# EAGLE design harp expander breakout v1.0 (EAGLE 9.5.1)
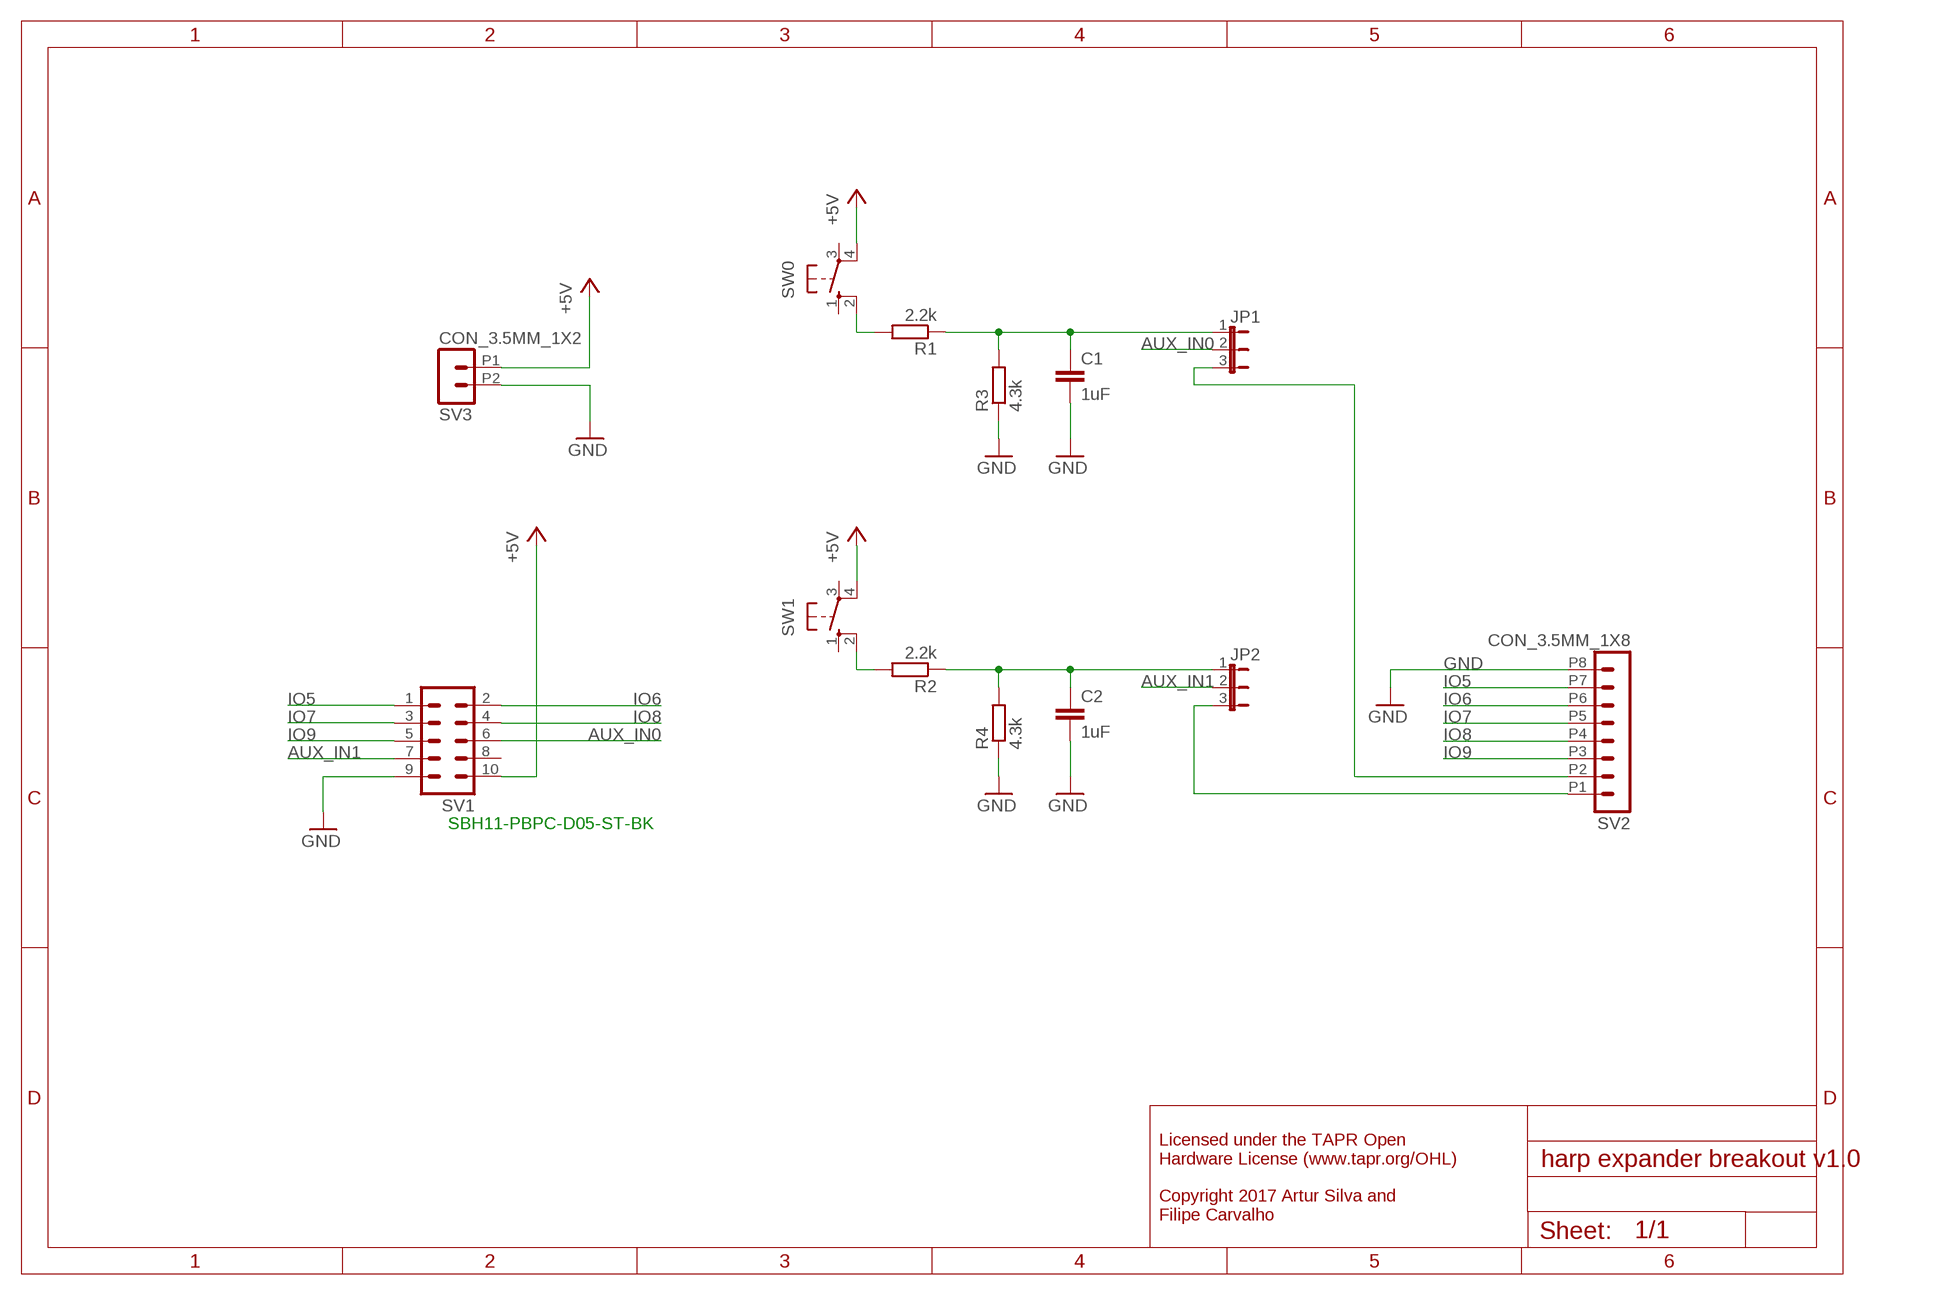
[diagram p0: schematic, sheet 1]

## Parts
C1  1uF  C-EUC0603  [C0603]
C2  1uF  C-EUC0603  [C0603]
JP1  JP2E  [JP2]
JP2  JP2E  [JP2]
R1  2.2k  R-EU_R0603  [R0603]
R2  2.2k  R-EU_R0603  [R0603]
R3  4.3k  R-EU_R0603  [R0603]
R4  4.3k  R-EU_R0603  [R0603]
SV1  ML10  [ML10]
SV2  CON_3.5MM_1X8  [CON_3.5MM_1X8]
SV3  CON_3.5MM_1X2  [CON_3.5MM_1X2]
SW0  40-XX  [B3F-40XX]
SW1  40-XX  [B3F-40XX]

## Nets
+5V: SV1.10 SV3.P1 SW0.4(P1) SW1.4(P1)
AUX_IN0: JP1.2 SV1.6
AUX_IN0_CONNECTOR: JP1.3 SV2.P2
AUX_IN1: JP2.2 SV1.7
AUX_IN1_CONNECTOR: JP2.3 SV2.P1
GND: C1.2 C2.2 R3.1 R4.1 SV1.9 SV2.P8 SV3.P2
IO5: SV1.1 SV2.P7
IO6: SV1.2 SV2.P6
IO7: SV1.3 SV2.P5
IO8: SV1.4 SV2.P4
IO9: SV1.5 SV2.P3
N$14: R2.2 SW1.2(S1)
N$16: C2.1 JP2.1 R2.1 R4.2
N$24: R1.2 SW0.2(S1)
N$25: C1.1 JP1.1 R1.1 R3.2
Unconnected: SV1.8 SW0.1(S) SW0.3(P) SW1.1(S) SW1.3(P)

## Notes on the sheet
- SBH11-PBPC-D05-ST-BK
- Licensed under the TAPR Open
  Hardware License (www.tapr.org/OHL)
  
  Copyright 2017 Artur Silva and 
  Filipe Carvalho

## Library data of the parts
C1 C2 = rcl:C-EU: CAPACITOR, European symbol
JP1 JP2 = jumper:JP2E: JUMPER
R1-R4 = rcl:R-EU_: RESISTOR, European symbol
SV1 = con-ml:ML10: HARTING; OC_FARNELL: unknown; OC_NEWARK: unknown
SV2 = CNP-connectors:CON_3.5MM_1X8
SV3 = CNP-connectors:CON_3.5MM_1X2
SW0 SW1 = switch-omron:40-XX: OMRON SWITCH; MF: OMRON COMPONENTS USA; MPN: B3F-4000; OC_FARNELL: 176434; OC_NEWARK: 36K3105

## Board
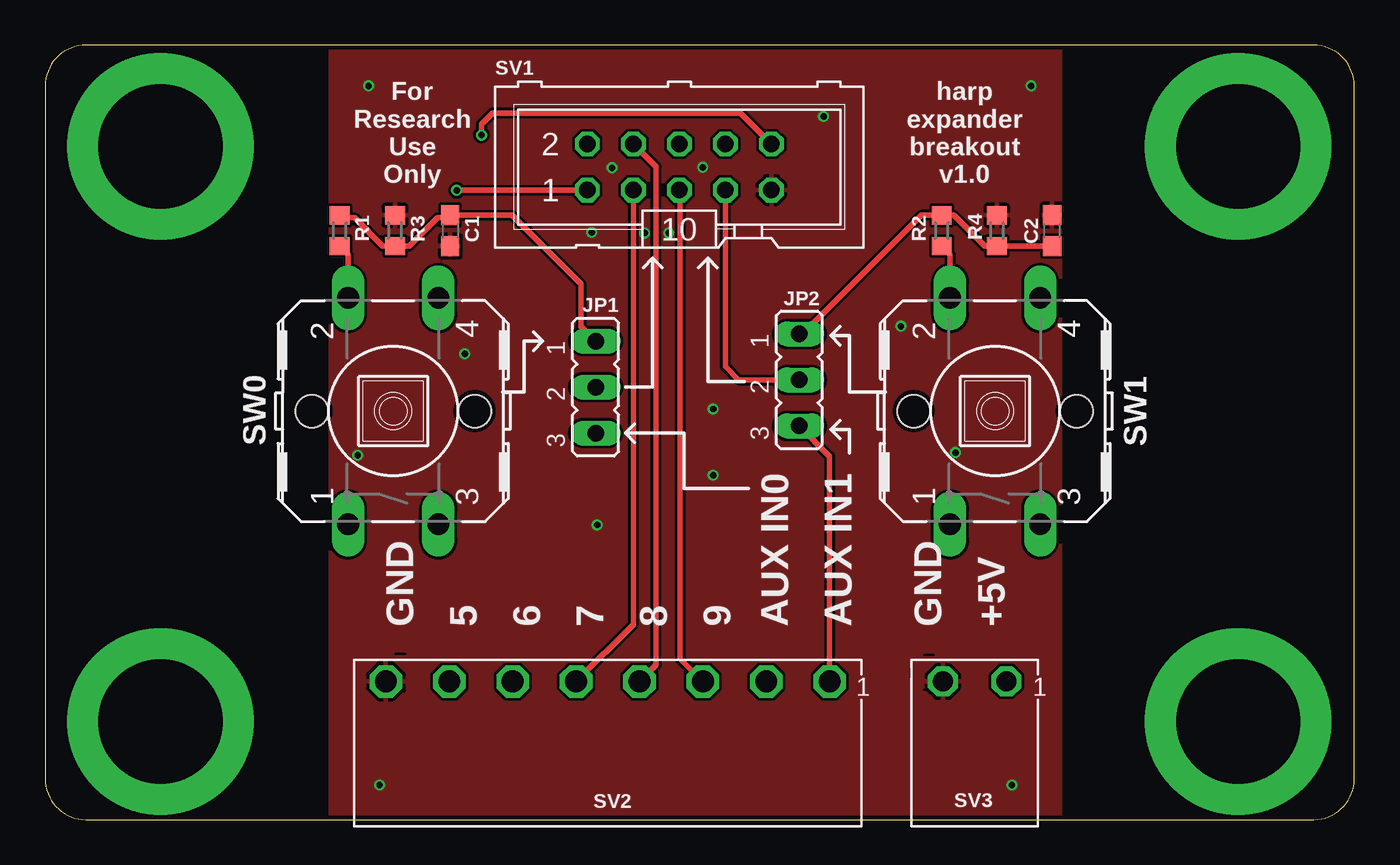
[diagram p1: board, top side]
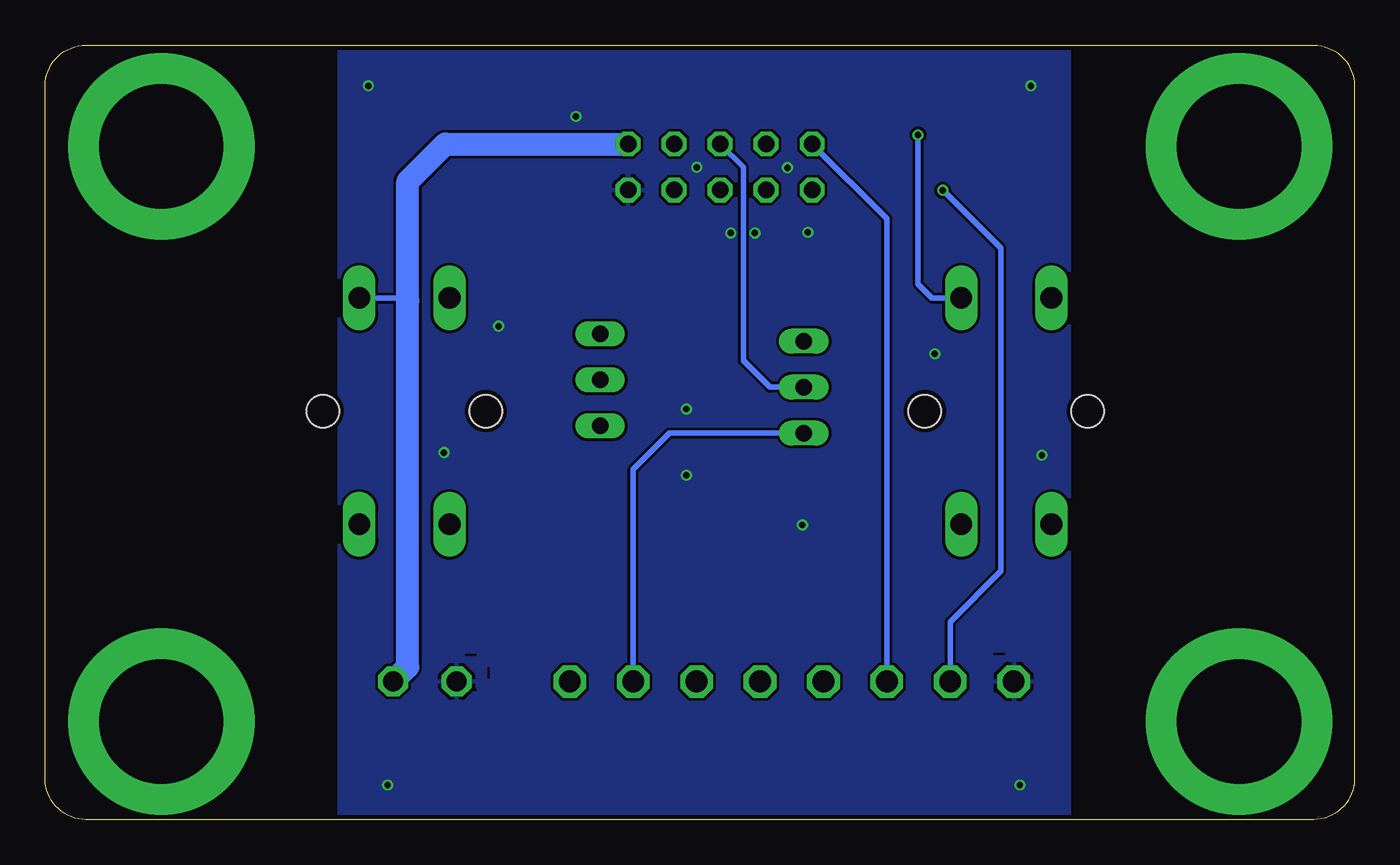
[diagram p2: board, bottom side, seen from below]

Size 72.25 x 42.75 mm. Coordinates in mm from the lower left corner, seen from the top.
Outline: 70.01,42.75 2.24,42.75 arc90 0,40.51 0,2.24 arc90 2.24,0 70.01,0 arc90 72.25,2.24 72.25,40.51 arc90 70.01,42.75
Copper layers (1*16): Top 0.018mm / dielectric 1.55mm / Bottom 0.018mm
Design rules "eC_2Layer_PClass6_BaseCopperO18_eCDefault *": minimum track width 6mil, minimum drill 0.35mm, track to track 6mil, track to pad 6mil, pad to pad 6mil, via to via 6mil, smd to smd 0mil, copper to edge 0.25mm, drill to drill 0.35mm, minimum pad ring 0.175mm, minimum via ring 0.125mm, stop-mask expansion 0mil, vias tented up to drill 0.45mm, thermal gap 0.2mm
tRestrict: 9 lines
bRestrict: 6 lines

### Footprints (pad centres in the part's own frame; a part is rotated, then mirrored left to right if it is on the bottom)
C0603 = smd 1.1 x 1: 1 -0.85,0; 2 0.85,0
JP2 = drill 0.914 long: 1 -2.54,0; 2 0,0; 3 2.54,0
R0603 = smd 1 x 1.1: 1 -0.85,0; 2 0.85,0
ML10 = drill 0.914 octagon: 1 -5.08,-1.27; 2 -5.08,1.27; 3 -2.54,-1.27; 4 -2.54,1.27; 5 0,-1.27; 6 0,1.27; 7 2.54,-1.27; 8 2.54,1.27; 9 5.08,-1.27; 10 5.08,1.27
CON_3.5MM_1X8 = drill 1.2 octagon: P1 -12.25,0; P2 -8.75,0; P3 -5.25,0; P4 -1.75,0; P5 1.75,0; P6 5.25,0; P7 8.75,0; P8 12.25,0
CON_3.5MM_1X2 = drill 1.1 octagon: P1 -2.09,0; P2 1.41,0
B3F-40XX = drill 1.194 long: 1 -6.248,2.489; 2 6.248,2.489; 3 -6.248,-2.489; 4 6.248,-2.489 | hole 1.803: 0,-4.496; 0,4.496

### Placement (x,y rotation side)
C1  22.35,32.51 270 top
C2  55.58,32.51 90 top
JP1  30.38,23.88 270 top
JP2  41.63,24.27 270 top
R1  16.26,32.51 270 top
R2  49.48,32.51 270 top
R3  19.3,32.51 270 top
R4  52.53,32.51 270 top
SV1  35,36.03 0 top
SV2  31.05,7.63 180 top
SV3  50.96,7.63 180 top
SW0  19.2,22.56 90 top
SW1  52.43,22.56 90 top

### Tracks (layer width: path | path; a pad name or v marks a point on that pad's centre or on a via)
+5V  (via drill 0.35)
  Top 0.305: SV1.10 38.37,39.01 24.69,39.01 24.08,38.41 v24.08,37.8
  Bottom 0.305: v24.08,37.8 24.08,29.57 23.32,28.8 SW0.4 | SW1.4 52.4,28.8 52.25,28.65
  Bottom 1.27: SV1.10 50.18,37.3 52.25,35.23 52.25,28.65 52.25,8.43 SV3.P1
AUX_IN0
  Bottom 0.305: JP1.2 32.26,23.88 33.72,25.34 33.72,36.02 SV1.6
AUX_IN0_CONNECTOR
  Bottom 0.305: SV2.P2 39.8,19.33 37.8,21.34 JP1.3
AUX_IN1
  Top 0.305: SV1.7 37.54,25.01 38.27,24.27 JP2.2
AUX_IN1_CONNECTOR
  Top 0.305: JP2.3 43.3,20.06 SV2.P1
GND  (via drill 0.35)
  other vias: 33.08,32.38 34.42,32.38 17.84,40.51 54.42,40.51 18.45,1.91 53.35,1.91 31.28,35.98 17.24,20.11 50.24,20.26 36.86,22.67 36.29,36.01 36.86,19.01 30.46,16.27 30.16,32.42 23.15,25.72 47.23,27.24 42.96,38.82
  pour Top: 15.75,42.75 55.99,42.75 55.99,0 15.75,0
  pour Bottom: 15.75,42.75 55.99,42.75 55.99,0 15.75,0
IO5  (via drill 0.35)
  Top 0.305: v22.71,34.75 29.91,34.75 SV1.1
  Bottom 0.305: SV2.P7 22.3,10.93 19.51,13.72 19.51,31.55 v22.71,34.75
IO6
  Bottom 0.305: SV2.P6 25.8,33.18 SV1.2
IO7
  Top 0.305: SV2.P5 32.46,10.79 SV1.3
IO8
  Top 0.305: SV2.P4 33.72,8.55 33.72,36.04 SV1.4
IO9
  Top 0.305: SV2.P3 35.04,8.88 35.04,34.75 35.02,34.76 SV1.5
N$14
  Top 0.305: R2.2 49.94,31.2 SW1.2
N$16
  Top 0.305: JP2.1 41.8,26.81 48.35,33.36 R2.1 50.15,33.36 51.85,31.66 R4.2 C2.1
N$24
  Top 0.305: R1.2 16.71,31.2 SW0.2
N$25
  Top 0.305: R1.1 16.39,33.22 17.07,33.22 18.63,31.66 R3.2 20.08,31.66 21.64,33.22 22.21,33.22 C1.1 25.77,33.36 29.57,29.57 29.57,27.23 JP1.1
S$1  (via drill 6.86)
  other vias: 6.35,37.16
S$3  (via drill 6.86)
  other vias: 6.35,5.41
S$6  (via drill 6.86)
  other vias: 65.85,37.16
S$8  (via drill 6.86)
  other vias: 65.85,5.41

### Text on the board
tPlace: For / Research / Use / Only | harp / expander / breakout / v1.0 | GND | 5 | 6 | 7 | 8 | 9 | AUX IN0 | AUX IN1 | GND | +5V